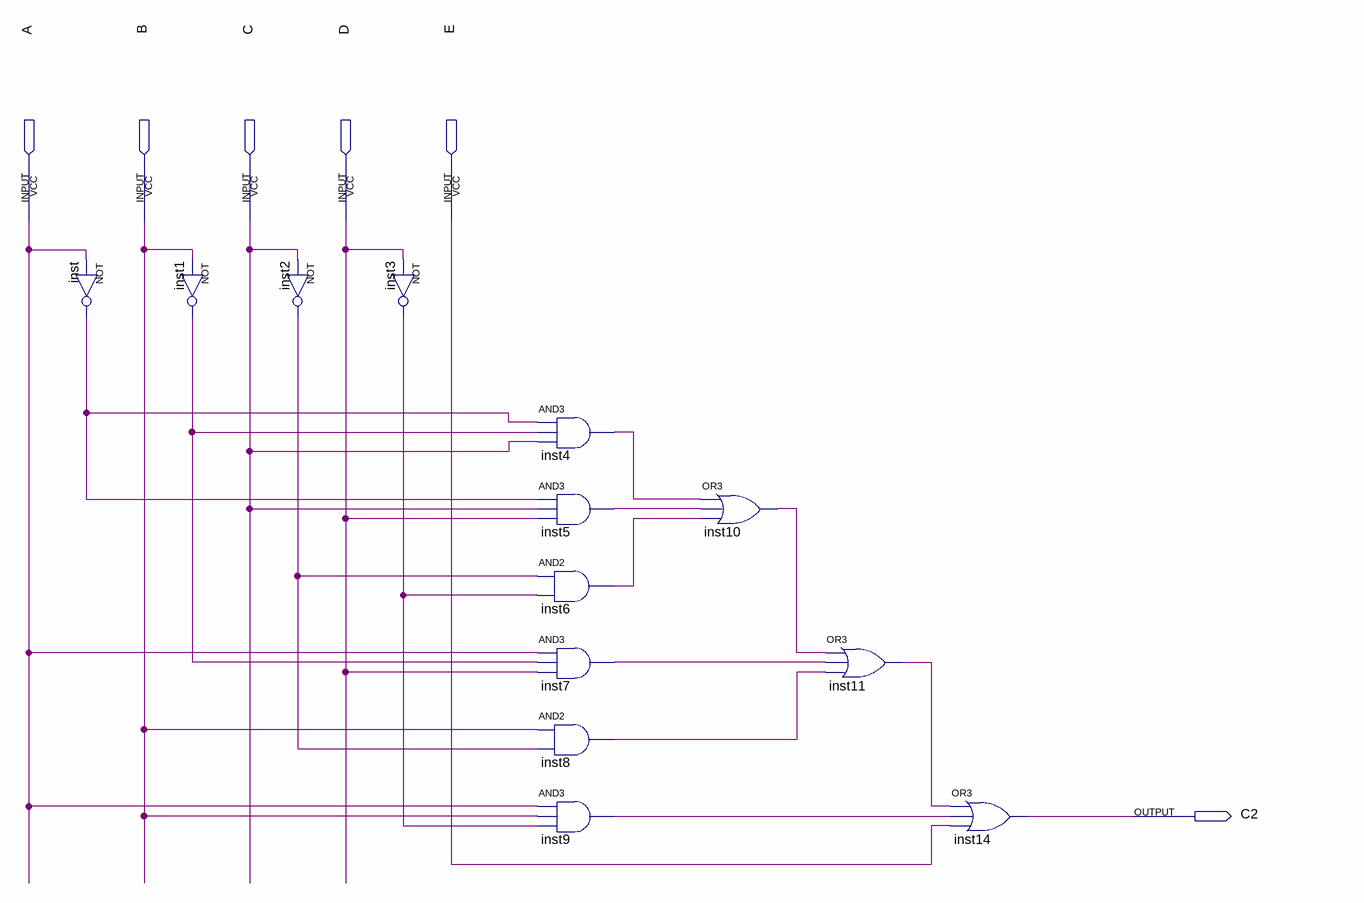
[diagram p0: schematic sheet]
// Quartus schematic led-C2.bdf as structural Verilog: 13 symbols, 6 pins
module \led-C2  (
  input  A,
  input  B,
  input  C,
  input  D,
  input  E,
  output C2
);

  wire inst1_out, inst2_out, inst3_out, inst4_out, inst5_out, inst6_out, inst7_out, inst8_out, inst9_out,
       inst10_out, inst11_out, inst_out;

  not inst (inst_out, A);
  not inst1 (inst1_out, B);
  not inst2 (inst2_out, C);
  not inst3 (inst3_out, D);
  and inst4 (inst4_out, inst_out, inst1_out, C);
  and inst5 (inst5_out, inst_out, C, D);
  and inst6 (inst6_out, inst2_out, inst3_out);
  and inst7 (inst7_out, A, inst1_out, D);
  and inst8 (inst8_out, B, inst2_out);
  and inst9 (inst9_out, A, B, inst3_out);
  or inst10 (inst10_out, inst4_out, inst5_out, inst6_out);
  or inst11 (inst11_out, inst10_out, inst7_out, inst8_out);
  or inst14 (C2, inst11_out, inst9_out, E);
endmodule
